# Altium schematic sheet RemoteShutter1.SchDoc: Remote Mobile Camera Shutter
size A4; DrawnBy: Deependra Dewagiri; Engineer: Deependra Dewagiri; Organization: Deependra Dewagiri; Revision: 3; SheetNumber: 1; SheetTotal: 2; SPICEModelCacheFSRUGMAC: <root> / <DocumentId>FSRUGMAC</DocumentId> / </root>
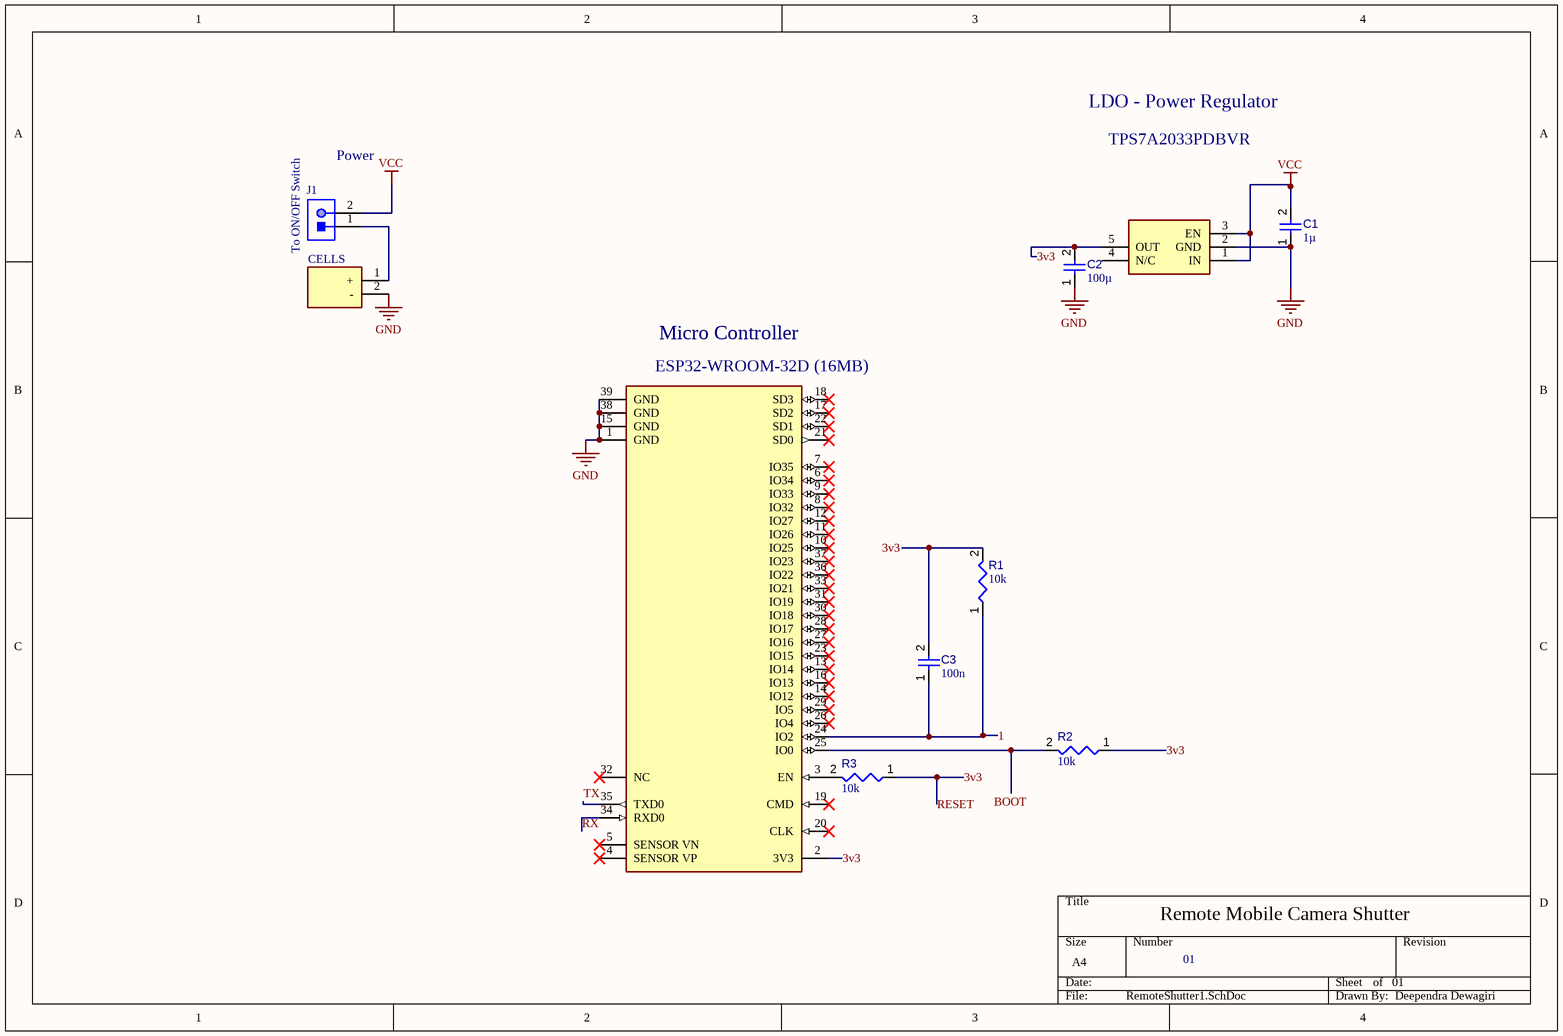
[diagram p0: RemoteShutter1.SchDoc]

## Parts
C1  value 1µ  [CAPC2013X145X50ML20T25]  (hidden comment: Capacitor 1 uF +/- 10% 25 V 0805)
C2  value 100µ  [CAPC0805(2012)145_L]  (hidden comment: Capacitor 100µF +/-20% 6.3V 0805)
C3  100n  [CAPC2013X95X50LL10T25]
CELLS  1062  [1062]  (value not drawn)
ESP32-WROOM-32D_(16MB)  ESP32-WROOM-32D (16MB)  [FP-ESP32-WROOM-32D_16MB-MFG]  (value not drawn)
J1  61300211121  [61300211121]  (value not drawn)
R1  value 10k  [RESC2013X50X35ML15T15]  (hidden comment: Resistor 10k +/-1% 0805 125 mW)
R2  value 10k  [RESC2013X50X35ML15T15]  (hidden comment: Resistor 10k +/-1% 0805 125 mW)
R3  value 10k  [RESC2013X50X35ML15T15]  (hidden comment: Resistor 10k +/-1% 0805 125 mW)
TPS7A2033PDBVR  TPS7A2033PDBVR  [SOT95P280X145-5N]  (value not drawn)

## Nets
GND: C1.1 C2.1 CELLS.2(-) ESP32-WROOM-32D_(16MB).1(GND) ESP32-WROOM-32D_(16MB).15(GND) ESP32-WROOM-32D_(16MB).38(GND) ESP32-WROOM-32D_(16MB).39(GND) TPS7A2033PDBVR.2(GND)
VCC: C1.2 J1.2 TPS7A2033PDBVR.1(IN) TPS7A2033PDBVR.3(EN)
1: C3.1 ESP32-WROOM-32D_(16MB).24(IO2) R1.1
3v3: C2.2 C3.2 ESP32-WROOM-32D_(16MB).2(3V3) R1.2 R2.1 R3.1 TPS7A2033PDBVR.5(OUT)  [also labelled RESET]
BOOT: ESP32-WROOM-32D_(16MB).25(IO0) R2.2
RX: ESP32-WROOM-32D_(16MB).34(RXD0)
TX: ESP32-WROOM-32D_(16MB).35(TXD0)
NetCELLS_1: CELLS.1(+) J1.1
NetESP32-WROOM-32D_(16MB)_3: ESP32-WROOM-32D_(16MB).3(EN) R3.2

Not connected (* = marked no-connect by the designer): ESP32-WROOM-32D_(16MB) 4(SENSOR_VP)* 5(SENSOR_VN)* 6(IO34)* 7(IO35)* 8(IO32)* 9(IO33)* 10(IO25)* 11(IO26)* 12(IO27)* 13(IO14)* 14(IO12)* 16(IO13)* 17(SD2)* 18(SD3)* 19(CMD)* 20(CLK)* 21(SD0)* 22(SD1)* 23(IO15)* 26(IO4)* 27(IO16)* 28(IO17)* 29(IO5)* 30(IO18)* 31(IO19)* 32(NC)* 33(IO21)* 36(IO22)* 37(IO23)*; TPS7A2033PDBVR 4(N/C)

## Notes on the sheet
- LDO - Power Regulator
- (near J1) Power
- (near J1) To ON/OFF Switch
- Micro Controller
- Remote Mobile Camera Shutter
- 01
- Deependra Dewagiri

## Library data of the parts
C1 = CMP-001-00010-6: Chip Capacitor, 1 uF, +/-10%, 25 V, 0805 (2012 Metric); Capacitor Type: Ceramic; Voltage Rating: 25V; RoHS Compliant: True; Pins: 2; Mounting Technology: SM; Max Operating Temperature: 125°C; Min Operating Temperature: -55°C; Tolerance: 10%; Case/Package: 0805
C2 = CMP-001-00054-4: Chip Capacitor, 100µF +/-20%, 6.3V, 0805, Thickness 1.45 mm; Tolerance: 10%; Min Operating Temperature: -55°C; Max Operating Temperature: 85°C; Pins: 2; Mounting Technology: SMT; Case/Package: 0805; Voltage Rating: 6.3V
C3 = CMP-001-00018-6: Chip Capacitor, 100 nF, +/- 10%, 50 V, 0805 (2012 Metric); Capacitor Type: Ceramic; Voltage Rating: 50V; Pins: 2; Value: 100n; Max Operating Temperature: 125°C; Min Operating Temperature: -55°C; Mounting Technology: SM; Case/Package: 0805; RoHS Compliant: True; Tolerance: 10%
CELLS = 1062: Battery; Manufacturer_Name: Keystone Electronics; Datasheet Link: https://www.keyelco.com/product-pdf.cfm?p=728; Height: 10.57mm; Manufacturer_Part_Number: 1062; Mouser Part Number: 534-1062; Mouser Price/Stock: https://www.mouser.co.uk/ProductDetail/Keystone-Electronics/1062?qs=TMDrOSIpnUdOWsMNtyKpVg%3D%3D
ESP32-WROOM-32D_(16MB) = CMP-194065-000022-1: RX TXRX MOD WIFI TRACE ANT SMD; Data Rate: 150Mbps; Memory Size: 536KB; Interface: I2C; Frequency: 2.5GHz; Sensitivity: -98dBm; Packaging: Tape and Reel; Min Operating Temperature: -40°C; Max Operating Temperature: 85°C; Mount: Surface Mount; Case/Package: SMD/SMT
J1 = CMP-1712-00002-4: THT Vertical Pin Header WR-PHD, Pitch 2.54 mm, Single Row, 2 pins; Manufacturer: Wurth Elektronik; Rated Current: 3A; Gender: Male; Withstanding Voltage: 500VAC; Working Voltage: 250VAC; Pitch: 2.54mm; Contact Resistance: 20mOhm; Pin Number: 2; Mounting Technology: THT; Orientation: Vertical; Operating Temperature: -40to105degC; Packaging: Bag; Publisher: WurthElektronik; Datasheet URL: https://katalog.we-online.de/em/datasheet/6130xx11121.pdf; Manufacturer URL: http://www.we-online.de; Row Number: Single; Package Reference: 61300211121; Part Number: 61300211121
R1-R3 = CMP-009-00018-5: Chip Resistor, 10 KOhm, +/- 1%, 125 mW, -55 to 155 degC, 0805 (2012 Metric); Power: 125mW; Voltage Rating: 150V; Tolerance: 1%; Pins: 2; Min Operating Temperature: -55°C; Case/Package: 0805; Max Operating Temperature: 155°C; RoHS Compliant: True; Mounting Technology: SM
TPS7A2033PDBVR = CMP-007-000000-1: 300-mA, Ultra-Low-Noise, Low-IQ, High PSRR LDO; Manufacturer_Name: Texas Instruments; Geometry.Height: 1.45mm; Mouser Part Number: 595-TPS7A2033PDBVR; Datasheet Link: https://www.ti.com/lit/ds/symlink/tps7a20.pdf?ts=1603960048570&ref_url=https%253A%252F%252Fwww.ti.com%252Fstore%252Fti%252Fen%252Fp%252Fproduct%252F%253Fp%253DPTPS7A2045PDQNR%2526keyMatch%253DPTPS7A2045PDQNR%2526tisearch%253DSearch-EN-everything; Mouser Price/Stock: https://www.mouser.co.uk/ProductDetail/Texas-Instruments/TPS7A2033PDBVR?qs=hd1VzrDQEGjk%2FOBnRfKB4A%3D%3D; Manufacturer_Part_Number: TPS7A2033PDBVR; Design Item ID: TPS7A2033PDBVR; Source: TPS7A2033PDBVR.SchLib